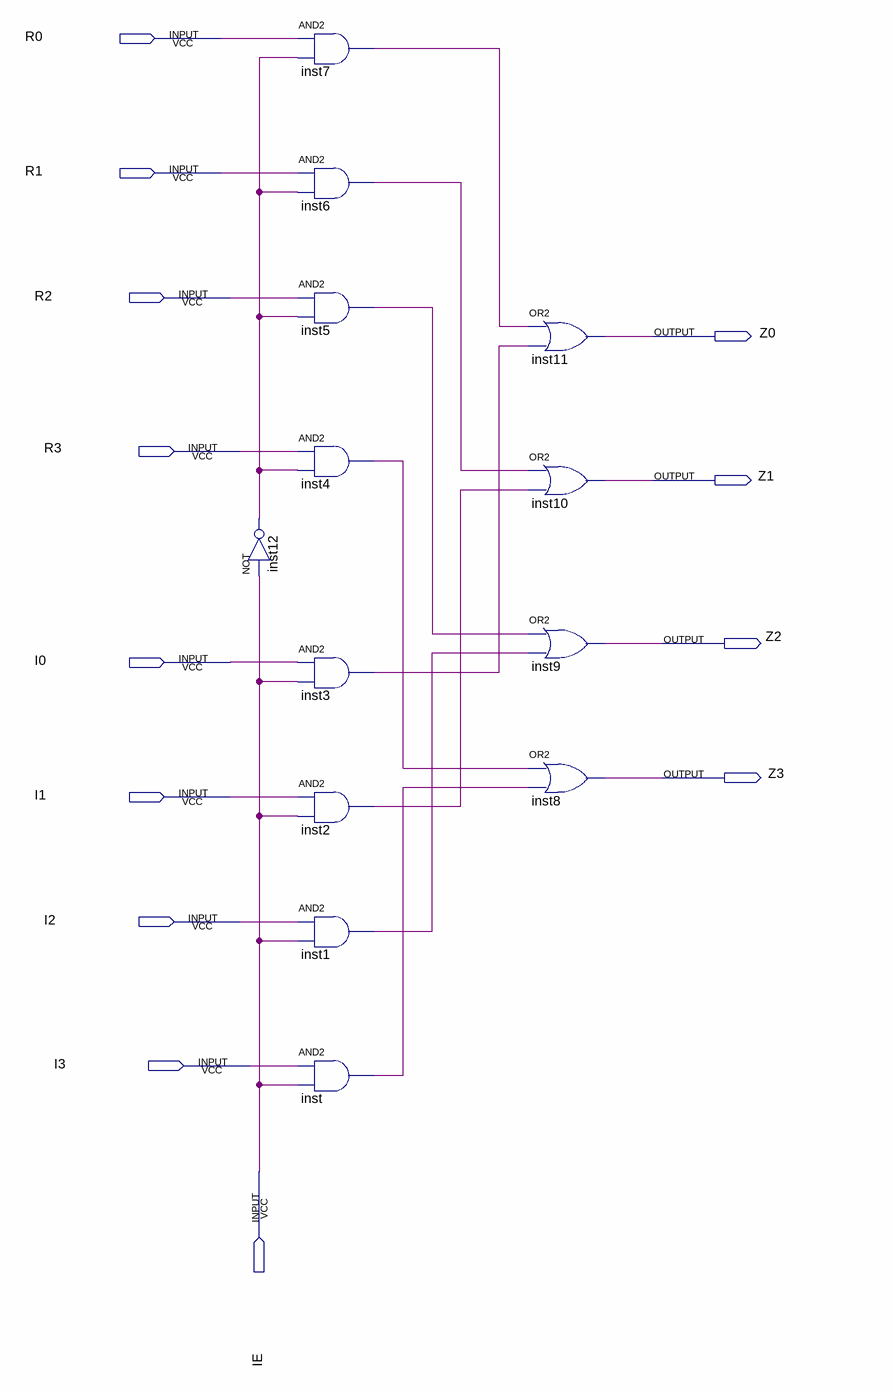
[diagram p0: schematic sheet]
// Quartus schematic SELECTOR.bdf as structural Verilog: 13 symbols, 13 pins
module SELECTOR (
  input  R0,
  input  R1,
  input  R2,
  input  R3,
  input  I0,
  input  I1,
  input  I2,
  input  I3,
  input  IE,
  output Z0,
  output Z1,
  output Z2,
  output Z3
);

  wire inst1_out, inst2_out, inst3_out, inst4_out, inst5_out, inst6_out, inst7_out, inst12_out, inst_out;

  not inst12 (inst12_out, IE);
  and inst7 (inst7_out, R0, inst12_out);
  and inst6 (inst6_out, R1, inst12_out);
  and inst5 (inst5_out, R2, inst12_out);
  and inst4 (inst4_out, R3, inst12_out);
  and inst3 (inst3_out, I0, IE);
  and inst2 (inst2_out, I1, IE);
  and inst1 (inst1_out, I2, IE);
  and inst (inst_out, I3, IE);
  or inst11 (Z0, inst7_out, inst3_out);
  or inst10 (Z1, inst6_out, inst2_out);
  or inst9 (Z2, inst5_out, inst1_out);
  or inst8 (Z3, inst4_out, inst_out);
endmodule
